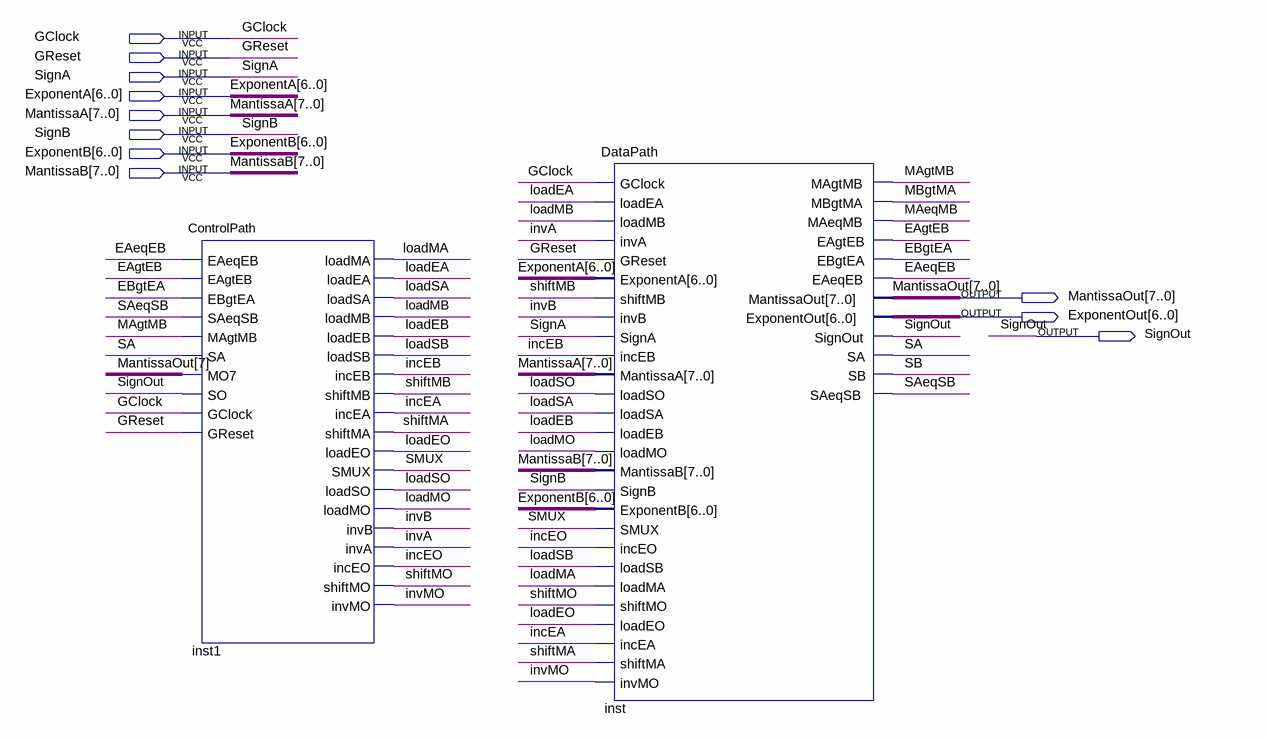
[diagram p0: schematic sheet]
// Quartus schematic lab1CEG3156.bdf as structural Verilog: 2 symbols, 11 pins
module lab1CEG3156 (
  input  GClock,
  input  GReset,
  input  SignA,
  input  [6:0] ExponentA,
  input  [7:0] MantissaA,
  input  SignB,
  input  [6:0] ExponentB,
  input  [7:0] MantissaB,
  output [7:0] MantissaOut,
  output [6:0] ExponentOut,
  output SignOut
);

  wire EAeqEB, EAgtEB, EBgtEA, incEA, incEB, incEO, invA, invB, invMO, loadEA, loadEB, loadEO, loadMA,
       loadMB, loadMO, loadSA, loadSB, loadSO, MAeqMB, MAgtMB, MBgtMA, SA, SAeqSB, SB, shiftMA, shiftMB,
       shiftMO, SMUX;

  ControlPath inst1 (
    .EAeqEB(EAeqEB), .EAgtEB(EAgtEB), .EBgtEA(EBgtEA), .SAeqSB(SAeqSB), .MAgtMB(MAgtMB), .SA(SA),
    .MO7(MantissaOut[7]), .SO(SignOut), .GClock(GClock), .GReset(GReset), .loadMA(loadMA), .loadEA(loadEA),
    .loadSA(loadSA), .loadMB(loadMB), .loadEB(loadEB), .loadSB(loadSB), .incEB(incEB), .shiftMB(shiftMB),
    .incEA(incEA), .shiftMA(shiftMA), .loadEO(loadEO), .SMUX(SMUX), .loadSO(loadSO), .loadMO(loadMO),
    .invB(invB), .invA(invA), .incEO(incEO), .shiftMO(shiftMO), .invMO(invMO));
  DataPath inst (
    .GClock(GClock), .loadEA(loadEA), .loadMB(loadMB), .invA(invA), .GReset(GReset), .ExponentA(ExponentA),
    .shiftMB(shiftMB), .invB(invB), .SignA(SignA), .incEB(incEB), .MantissaA(MantissaA), .loadSO(loadSO),
    .loadSA(loadSA), .loadEB(loadEB), .loadMO(loadMO), .MantissaB(MantissaB), .SignB(SignB),
    .ExponentB(ExponentB), .SMUX(SMUX), .incEO(incEO), .loadSB(loadSB), .loadMA(loadMA), .shiftMO(shiftMO),
    .loadEO(loadEO), .incEA(incEA), .shiftMA(shiftMA), .invMO(invMO), .MAgtMB(MAgtMB), .MBgtMA(MBgtMA),
    .MAeqMB(MAeqMB), .EAgtEB(EAgtEB), .EBgtEA(EBgtEA), .EAeqEB(EAeqEB), .MantissaOut(MantissaOut),
    .ExponentOut(ExponentOut), .SignOut(SignOut), .SA(SA), .SB(SB), .SAeqSB(SAeqSB));
endmodule
